# Altium schematic sheet PWM Driver.SchDoc
size A4
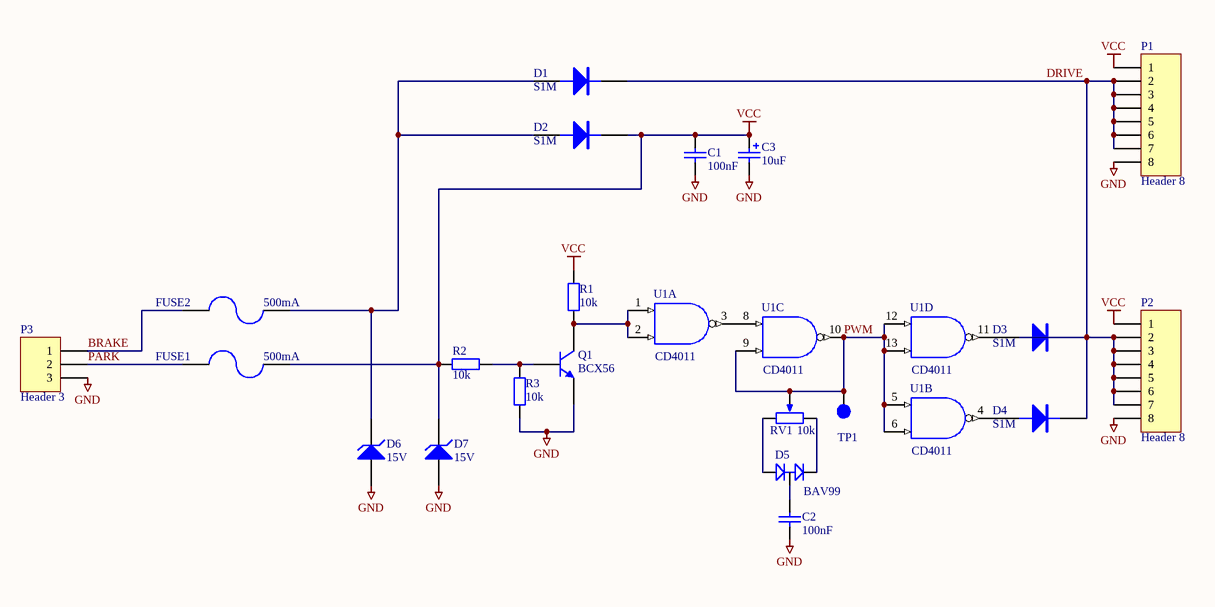
[diagram p0: PWM Driver.SchDoc]

## Parts
C1  100nF  [CAP (3D) - 0805]
C2  100nF  [CAP (3D) - 0805]
C3  value 10uF  [RB5-10.5]
D1  S1M  [DO-214AC]
D2  S1M  [DO-214AC]
D3  S1M  [DO-214AC]
D4  S1M  [DO-214AC]
D5  BAV99  [SOT23-3L]
D6  15V  [1N4001]
D7  15V  [1N4001]
FUSE1  500mA  [miniSMD Polyswitch]
FUSE2  500mA  [miniSMD Polyswitch]
P1  Header 8  [HDR1X8]
P2  Header 8  [HDR1X8]
P3  Header 3  [TAIL]
Q1  BCX56  [SOT89]
R1  value 10k  [RES (3D) - 0805]  (hidden comment: Res2)
R2  value 10k  [RES (3D) - 0805]  (hidden comment: Res2)
R3  value 10k  [RES (3D) - 0805]  (hidden comment: Res2)
RV1  10k  [TRIMPOT (10 TURN)]
TP1  TestPoint  [TP_TH]  (value not drawn)
U1  CD4011  [SOIC-14]  (parts A,B,C,D of 4)

## Nets
GND: C1.1 C2.1 C3.2 D6.2(A) D7.2(A) P1.8 P2.8 P3.3 Q1.3(E) R3.1 U1.7(GND)
VCC: C1.2 C3.1 D2.2(K) D7.1(K) FUSE1.2 P1.1 P2.1 R1.2 R2.2 U1.14(VCC)
BRAKE: FUSE2.1 P3.1
DRIVE: D1.2(K) D3.2(K) D4.2(K) P1.2 P1.3 P1.4 P1.5 P1.6 P1.7 P2.2 P2.3 P2.4 P2.5 P2.6 P2.7
PARK: FUSE1.1 P3.2
PWM: RV1.2 TP1.1 U1.5(A) U1.6(B) U1.9(B) U1.10(Y) U1.12(A) U1.13(B)
NetC2_2: C2.2 D5.3(C1/A2)
NetD1_1: D1.1(A) D2.1(A) D6.1(K) FUSE2.2
NetD3_1: D3.1(A) U1.11(Y)
NetD4_1: D4.1(A) U1.4(Y)
NetD5_1: D5.1(A1) RV1.1
NetD5_2: D5.2(C2) RV1.3
NetQ1_1: Q1.1(B) R2.1 R3.2
NetQ1_2: Q1.2(C) R1.1 U1.1(A) U1.2(B)
NetU1_3: U1.3(Y) U1.8(A)

## Library data of the parts
C1 C2 = Cap: Capacitor; Value: 100nF; Supplier 1: Mouser; Supplier 2: Digi-Key; Supplier Part Number 1: 603-C0603ZRY5V9BB104; Supplier Part Number 2: 311-1343-2-ND
C3 = Cap Pol2: Polarized Capacitor (Axial); Published: 8-Jun-2000; LatestRevisionDate: 17-Jul-2002; LatestRevisionNote: Re-released for DXP Platform.; PackageReference: POLAR0.8; Publisher: Altium Limited; PackageDescription: Polarized Capacitor; 2 Leads
D1-D4 = DIODE: DIODE, POWER; Manufacturer: TAIWAN SEMI; Mouser Part no.: 821-S1M; Manufacturer Part No.: S1M; value: S1M; Web link: http://au.mouser.com/ProductDetail/Taiwan-Semiconductor/S1M/?qs=sGAEpiMZZMtEwUVCuofpuOlSmRjzJonf%252bmrIm0%252bGbjE%3d
D5 = BAV99: DUAL DIODE, BAV99; Manufacturer: FAIRCHILD SEMICONDUCTOR; Mouser Part no.: 771-BAV99/T3; Farnell Part no.: 9843612; Manufacturer Part No.: BAV99; PackageReference: SOT-23; value: BAV99; Web link: http://au.mouser.com/ProductDetail/NXP-Semiconductors/BAV99-T3/?qs=sGAEpiMZZMtldOIVIVqa3WNg7zlWz8nBhXHsMX6ttIg%3d
D6 D7 = D Zener: ZENER 12V 1W; pin to pad: 1>2 2>1
FUSE1 FUSE2 = POLYSWITCH 500mA: Manufacturer: Tyco Electronics / Raychem; Manufacturer Part No.: MINISMDC050F-2; Mouser Part no.: 650-MINISMDC050F-2; Farnell Part no.: 1175839; Web link: http://au.mouser.com/ProductDetail/Tyco-Electronics-Raychem/MINISMDC050F-2/?qs=sGAEpiMZZMu7EFbsM1w0neRfX3mrvYIvOpkrchiUGng%3d
P1 P2 = Header 8: Header, 8-Pin; LatestRevisionDate: 17-Jul-2002; LatestRevisionNote: Re-released for DXP Platform.; Publisher: Altium Limited
P3 = Header 3: Header, 3-Pin; LatestRevisionDate: 17-Jul-2002; LatestRevisionNote: Re-released for DXP Platform.; Publisher: Altium Limited
Q1 = BCX56: PNP Bipolar Transistor; Revision: July-2002: Re-released for DXP Platform.
R1-R3 = Res2: Resistor
RV1 = VAR (POT) SMD: Variable Resistor; Manufacturer: Bourns; Manufacturer Part No.: CR0603FX-1002ELF; Value: 10k; Mouser Part no.: 652-CR0603FX-1002ELF; Web link: http://au.mouser.com/Search/Refine.aspx?Keyword=652-CR0603FX-1002ELF
U1 = CD4011: Quadruple 2-Input Positive-NAND Gate